# Altium schematic sheet 5V_power.SchDoc
size A; SheetNumber: 1; SheetTotal: 2; SPICEModelCacheWKJFUFVT: <root> / <DocumentId>WKJFUFVT</DocumentId> / <CacheFrame Number="0"> / <Model Name="vconst" Kind="mdl"> / <Text>Vconst node+ node- 5</Text> / </Model> / </CacheFrame> / </root>
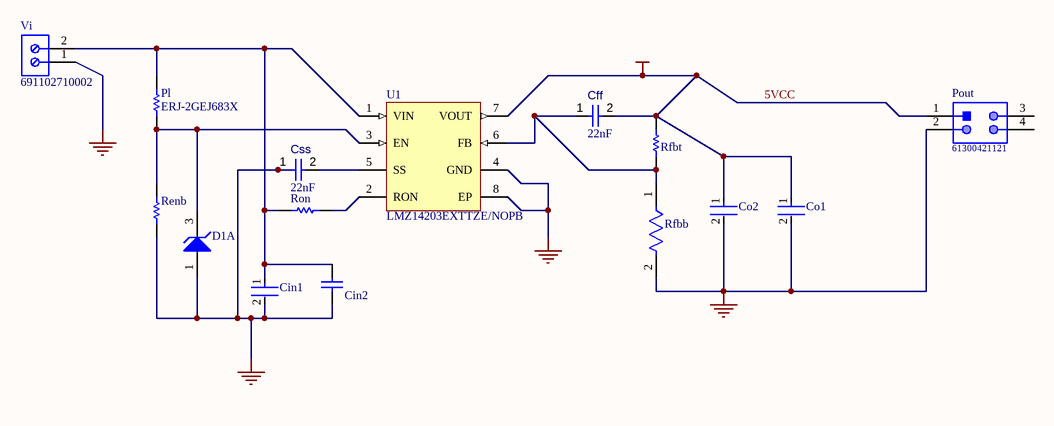
[diagram p0: 5V_power.SchDoc]

## Parts
Cff  value 22nF  [FP-C0805C-DN-MFG]  (hidden comment: C0805C223K5RACTU)
Cin1  CC0603KRX7R5BB105  [FP-CC0603-DA-MFG]  (value not drawn)
Cin2  CAP 10uF 25V 1206(3216)  [CAPC1206(3216)190_N]  (value not drawn)
Co1  CC0603KRX7R5BB105  [FP-CC0603-DA-MFG]  (value not drawn)
Co2  CL32A107MQVNNNE  [FP-CL32-IPC_C]  (value not drawn)
Css  value 22nF  [FP-C0805C-DN-MFG]  (hidden comment: C0805C223K5RACTU)
D1  MMBZ5231BLT1G  [ONSC-SOT-23-3-318-08_V]  (value not drawn)  (part A of 2)
Pl  ERJ-2GEJ683X  [RESC1005X40X25LL05T05]
Pout  61300421121  [61300421121]
Renb  ERJ-3EKF1182V  [RESC1608X55X30LL15T15]  (value not drawn)
Rfbb  RP73PF1J1K07BTDF  [FP-RP73P-1J-MFG]  (value not drawn)
Rfbt  CRCW02015K62FNED  [RESC0603X28X15NL05T05]  (value not drawn)
Ron  CRCW0201100KJNED  [RESC0603X28X15NL05T05]  (value not drawn)
U1  LMZ14203EXTTZE/NOPB  [TZA07A_V]
Vi  691102710002  [691102710002]

## Nets
5VCC: Cff.2 Co1.1 Co2.1 Pout.1 Rfbt.2 U1.7(VOUT)  [also labelled +5]
GND: Cin1.2 Cin2.1 Co1.2 Co2.2 Css.1 D1.1(A) Pout.2 Renb.1 Rfbb.2 U1.4(GND) U1.8(EP) Vi.1
NetCff_1: Cff.1 Rfbb.1 Rfbt.1 U1.6(FB)
NetCin1_1: Cin1.1 Cin2.2 Pl.2 Ron.1 U1.1(VIN) Vi.2
NetCss_2: Css.2 U1.5(SS)
NetD1_3: D1.3(K) Pl.1 Renb.2 U1.3(EN)
NetRon_2: Ron.2 U1.2(RON)

Not connected (* = marked no-connect by the designer): Pout 3 4

## Library data of the parts
Cff Css = CMP-001-00062-3: Chip Capacitor, 22nF +/-20%, 10V, 0402, Thickness 0.6 mm; Tolerance: 10%; Min Operating Temperature: -55°C; Case/Package: 0402; Pins: 2; Max Operating Temperature: 85°C; Mounting Technology: SMT; Voltage Rating: 10V
Cin1 Co1 = CMP-03422-000406-1: 0603 1 uF 6.3 V ±10 % Tolerance X7R SMT Multilayer Ceramic Capacitor; Manufacturer: YAGEO; Tolerance: 0.1; Temperature Coefficient: 15%; Capacitance: 1 uF; Value: 1 uF; Voltage Rating: 6.3 V; Temperature Range High: +125°C; Octopart: https://octopart.com/cc0603krx7r5bb105-yageo-11543596; Device Class L2: Capacitors; Package: CC0603-DA; RoHS: TRUE; Digikey Description: 0603 1 uF 6.3 V ±10 % Tolerance X7R SMT Multilayer Ceramic Capacitor; Category: Cap; ComponentLink2URL: http://www.yageo.com/documents/recent/UPY-GPHC_X7R_6.3V-to-50V_18.pdf; Lead Free: Yes; Material: Ceramic; Mouser Description: 0603 1 uF 6.3 V ±10 % Tolerance X7R SMT Multilayer Ceramic Capacitor; Device Class L1: Passive Components; Device Class L3: Ceramic Capacitors; ComponentLink2Description: Datasheet; Automotive: No; Height: 0.9mm; Manufacturer Part Number: CC0603KRX7R5BB105; Voltage: 6.3 V; Temperature: -55°C to +125°C; Temperature Characteristic: X7R; Footprint Url: http://www.yageo.com/exep/pages/download/literatures/UPY-C_GEN_24.pdf; Temperature Range Low: -55°C
Cin2 = CMP-1037-04981-1: CAP 10uF 25V -20% to +80% 1206 (3216 Metric) Thickness 1.9mm SMD; Case-EIA: 1206; Case-Metric: 3216; Value: 10uF; Tolerance: -20% to +80%; Max Thickness: 1.9 mm; Rated Voltage: 25 V; Technology: SMT
Co2 = CMP-13271-001330-1: CAP CER 100UF 6.3V X5R 1210; Tolerance: 20%; Voltage: 6.3V; Voltage Rating (DC): 6.3V; Length: 3.2mm; Width: 0.098inch; Material: Ceramic; Thickness: 0.11inch; Dielectric: X5R; Packaging: Tape and Reel; Voltage Rating: 6.3V; Min Operating Temperature: -55°C; Lead Free: Lead Free; Radiation Hardening: No; Case Code (Imperial): 1210; Height: 2.5mm; Capacitance: 100uF; Depth: 2.5mm; Case Code (Metric): 3225; Mount: Surface Mount; Package Quantity: 1; Case/Package: 1210; Max Operating Temperature: 85°C; Contact Plating: Tin
D1 = CMP-1060-00985-1: Zener Voltage Regulator, 225 mW, 3-Pin SOT-23, Pb-Free, Tape and Reel; Manufacturer: On Semiconductor; VZ Typ (V): 5.1; Packing: Tape and Reel; ComponentLink1Description: Manufacturer URL; PartNumber: MMBZ5231BLT1G; PackageReference: SOT-23-3-318-08; ComponentLink1URL: http://www.onsemi.com/; ComponentLink3URL: http://www.onsemi.cn/pub_link/Collateral/318-08.PDF; Mounting Technology: Surface Mount; ComponentLink2Description: Datasheet; DatasheetVersion: Rev. 12; ComponentLink3Description: Package Specification; PackageVersion: Rev. AP, 11/2009; ComponentLink2URL: http://www.onsemi.cn/pub_link/Collateral/MMBZ5221BLT1-D.PDF; RoHS: Pb-Free; PackageDescription: 3-Pin Small Outline Transistor, Body 2.92 x 1.3 mm, Pitch 0.95 mm
Pl = CMP-2002-00573-1: Manufacturer: Panasonic; Part Number: ERJ-2GEJ683X
Pout = CMP-1502-01066-1: THT Vertical Pin Header WR-PHD, Pitch 2.54 mm, Dual Row, 4 pins; Manufacturer: Wurth Elektronik; Working Voltage: 250VAC; Contact Resistance: 20mOhm; Pitch: 2.54mm; Rated Current: 3A; Withstanding Voltage: 500VAC; Pin Number: 4; Gender: Male; Operating Temperature: -40to105degC; Packaging: Bag; Manufacturer URL: http://www.we-online.de; Package Reference: 61300421121; Row Number: Dual; Publisher: WurthElektronik; Mounting Technology: THT; Orientation: Vertical; Part Number: 61300421121; Datasheet URL: https://katalog.we-online.de/em/datasheet/6130xx21121.pdf
Renb = CMP-2000-00210-1: Manufacturer: Panasonic; Part Number: ERJ-3EKF1182V
Rfbb = CMP-03211-001820-1: RES SMD 1.07K OHM 0.1% 1/6W 0603; Manufacturer: TE Connectivity; Voltage Rating: 100V; Temperature Coefficient: 25ppm/°C; Resistance: 1.07KΩ; Value: 1.07KΩ; Power Rating: 0.166W; Tolerance: 0.001; Height: 0.55mm; Manufacturer Part Number: RP73PF1J1K07BTDF; Device Class L2: Resistors; Category: Res; Lead Free: Yes; Ipc Land Pattern Name: RESC15580X45; RoHS: TRUE; ComponentLink2URL: https://www.te.com/commerce/DocumentDelivery/DDEController?Action=srchrtrv&DocNm=1773272&DocType=DS&DocLang=English; Temperature: -55°C to +155°C; Temperature Range Low: -55°C; Device Class L1: Passive Components; Package: RP73P-1J; Octopart: https://octopart.com/rp73pf1j1k07btdf-te+connectivity-45465727; Automotive: No; Series: RP73P; Composition: Thin Film; Device Class L3: Chip SMD Resistors; ComponentLink2Description: Datasheet; Temperature Range High: +155°C; Digikey Description: RES SMD 1.07K OHM 0.1% 1/6W 0603; Mouser Description: TE CONNECTIVITY - RP73PF1J1K07BTDF - RES, THIN FILM, 1K07, 0.1%, 0.166W, 0603
Rfbt = CMP-2004-00748-1: 5.62k; Manufacturer: Vishay Dale; Part Number: CRCW02015K62FNED
Ron = CMP-2004-00004-1: 100k; Manufacturer: Vishay; Part Number: CRCW0201100KJNED
U1 = CMP-0069-00343-2: 3A SIMPLE SWITCHER® Power Module with 42V Maximum Input Voltage for Military and Rugged Applications, 7 pin TO-PMOD; Manufacturer: National Semiconductor; High-Reliability: Y; PackageTopMarking: NSUZXYTTE#*LMZ14203*EXT; CompType: Switcher; ComponentLink3Description: LMZ14203EXT Web Page; PackageReference: TZA07A; PartNumber: LMZ14203EXTTZE/NOPB; RevisionNote: Footprint updated according to revison D of 'tza07a.pdf'. Component URLs added; PowerWise: Y; RoHS: Y; ComponentLink1Description: Manufacturer URL; ComponentLink4Description: TZA07A Package Page; PackageDescription: TO-PMOD-7, 10.16 x 9.85 x 4.57 mm Body, 7 Lead, 1.27mm Pitch, Surface Mount; DatasheetVersion: Aug-2010; ComponentLink2Description: LMZ14203EXT Datasheet; ComponentLink3URL: http://www.national.com/pf/LM/LMZ14203EXT.html; ComponentLink2URL: http://www.national.com/ds/LM/LMZ14203EXT.pdf; ComponentLink4URL: http://www.national.com/packaging/folders/tza07a.html; PinCount: 7; PackageVersion: revD, Apr-2011; ComponentLink1URL: http://www.national.com/
Vi = CMP-1502-03258-1: Series 102 - 5.00 mm Horizontal Entry Modular with Pressure Clamp WR-TBL, 2 pin; Manufacturer: Wurth Elektronik; Pin Number: 2; Pitch: 5.00mm; Manufacturer URL: http://www.we-online.de; Mounting Technology: THT; Publisher: WurthElektronik; Packaging: Box; Package Reference: 691102710002; Datasheet URL: http://katalog.we-online.de/em/datasheet/6911027100xx.pdf; Operating Temperature: -40to105degC; Part Number: 691102710002